# Altium project OSP_DJB_JIG.PrjPcb
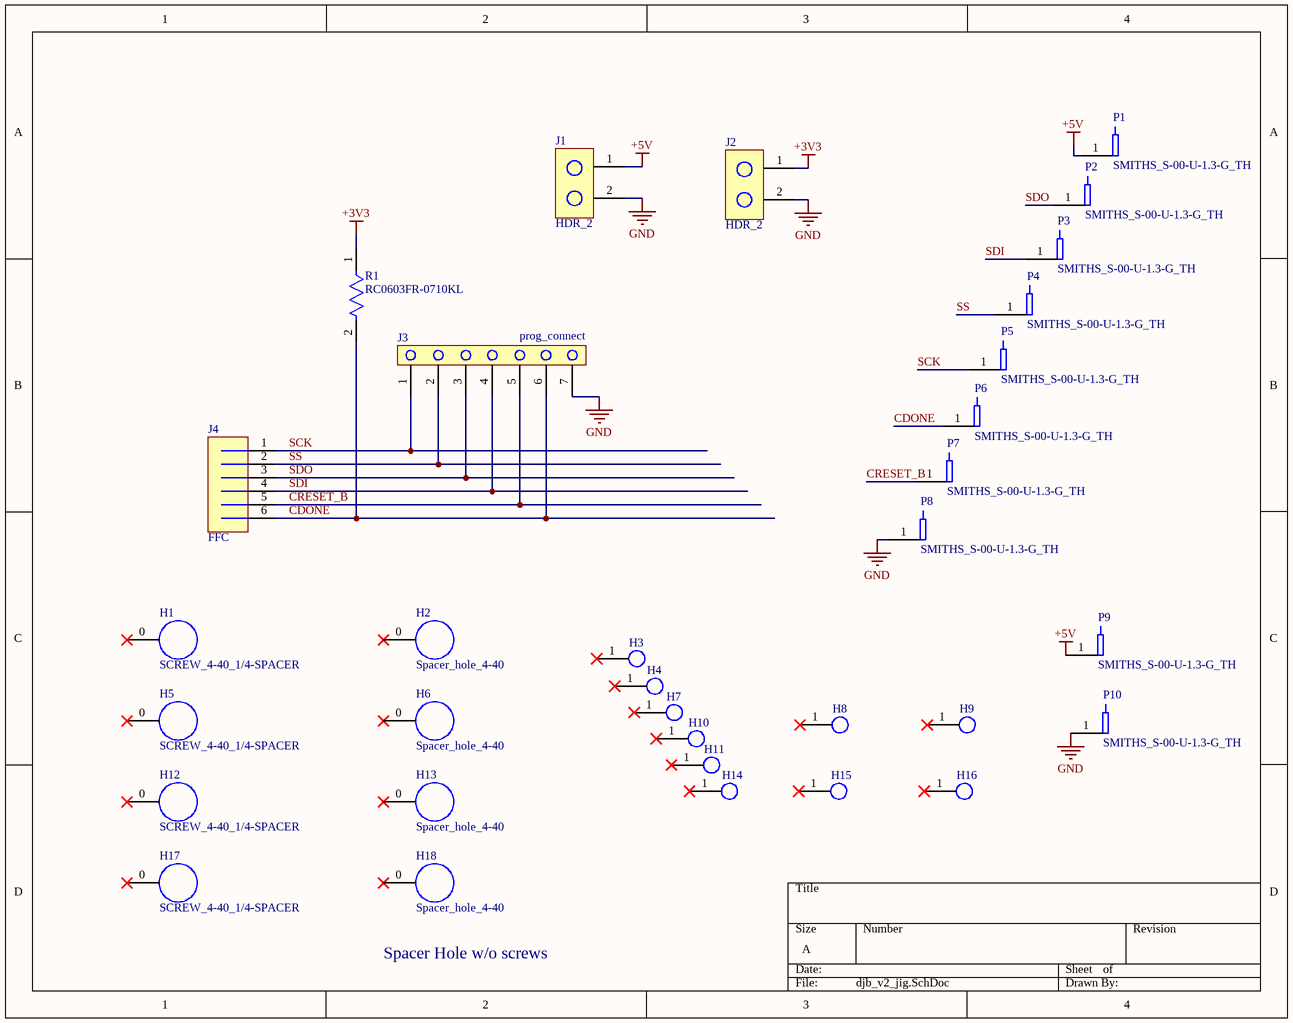
[diagram p0: djb_v2_jig.SchDoc]
1 sheet, 33 parts. Net scope: global (net labels, ports and power ports of the same name join across sheets).
Board files: djb_v2_jig_a.PcbDoc, djb_v2_jig_b.PcbDoc

## Sheet djb_v2_jig.SchDoc
size A; SheetNumber: 1; SheetTotal: 1

### Parts
H1  SCREW_4-40_1/4-SPACER  [SCREW_4-40_1/4-SPACER]
H2  Spacer_hole_4-40  [SPACER_HOLE_4-40]
H3  SMITHS_S-00-U-1.3_hole  [SMITHS_S-00-U-1.3_hole]  (value not drawn)
H4  SMITHS_S-00-U-1.3_hole  [SMITHS_S-00-U-1.3_hole]  (value not drawn)
H5  SCREW_4-40_1/4-SPACER  [SCREW_4-40_1/4-SPACER]
H6  Spacer_hole_4-40  [SPACER_HOLE_4-40]
H7  SMITHS_S-00-U-1.3_hole  [SMITHS_S-00-U-1.3_hole]  (value not drawn)
H8  SMITHS_S-00-U-1.3_hole  [SMITHS_S-00-U-1.3_hole]  (value not drawn)
H9  SMITHS_S-00-U-1.3_hole  [SMITHS_S-00-U-1.3_hole]  (value not drawn)
H10  SMITHS_S-00-U-1.3_hole  [SMITHS_S-00-U-1.3_hole]  (value not drawn)
H11  SMITHS_S-00-U-1.3_hole  [SMITHS_S-00-U-1.3_hole]  (value not drawn)
H12  SCREW_4-40_1/4-SPACER  [SCREW_4-40_1/4-SPACER]
H13  Spacer_hole_4-40  [SPACER_HOLE_4-40]
H14  SMITHS_S-00-U-1.3_hole  [SMITHS_S-00-U-1.3_hole]  (value not drawn)
H15  SMITHS_S-00-U-1.3_hole  [SMITHS_S-00-U-1.3_hole]  (value not drawn)
H16  SMITHS_S-00-U-1.3_hole  [SMITHS_S-00-U-1.3_hole]  (value not drawn)
H17  SCREW_4-40_1/4-SPACER  [SCREW_4-40_1/4-SPACER]
H18  Spacer_hole_4-40  [SPACER_HOLE_4-40]
J1  HDR_2  [2-POS_HEADER]
J2  HDR_2  [2-POS_HEADER]
J3  prog_connect  [7-pos_header]
J4  FFC  [AMPHENOL_HFW6R-1STE1LF]
P1  SMITHS_S-00-U-1.3-G_TH  [SMITHS_S-00-U-1.3-G_TH]
P2  SMITHS_S-00-U-1.3-G_TH  [SMITHS_S-00-U-1.3-G_TH]
P3  SMITHS_S-00-U-1.3-G_TH  [SMITHS_S-00-U-1.3-G_TH]
P4  SMITHS_S-00-U-1.3-G_TH  [SMITHS_S-00-U-1.3-G_TH]
P5  SMITHS_S-00-U-1.3-G_TH  [SMITHS_S-00-U-1.3-G_TH]
P6  SMITHS_S-00-U-1.3-G_TH  [SMITHS_S-00-U-1.3-G_TH]
P7  SMITHS_S-00-U-1.3-G_TH  [SMITHS_S-00-U-1.3-G_TH]
P8  SMITHS_S-00-U-1.3-G_TH  [SMITHS_S-00-U-1.3-G_TH]
P9  SMITHS_S-00-U-1.3-G_TH  [SMITHS_S-00-U-1.3-G_TH]
P10  SMITHS_S-00-U-1.3-G_TH  [SMITHS_S-00-U-1.3-G_TH]
R1  RC0603FR-0710KL  [FP-RC0603-0_55-IPC_C]

### Nets
+3V3: J2.1 R1.1
+5V: J1.1 P1.1 P9.1
GND: J1.2 J2.2 J3.7 P8.1 P10.1
CDONE: J3.6 J4.6 P6.1 R1.2
CRESET_B: J3.5 J4.5 P7.1
SCK: J3.1 J4.1 P5.1
SDI: J3.4 J4.4 P3.1
SDO: J3.3 J4.3 P2.1
SS: J3.2 J4.2 P4.1

Not connected (* = marked no-connect by the designer): H1 0*; H2 0*; H3 1*; H4 1*; H5 0*; H6 0*; H7 1*; H8 1*; H9 1*; H10 1*; H11 1*; H12 0*; H13 0*; H14 1*; H15 1*; H16 1*; H17 0*; H18 0*

### Notes on the sheet
- Spacer Hole w/o screws

### Library data of the parts
H1 H5 H12 H17 = SCREW_4-40_1/4-SPACER: Hole for 4-40 screw with 1/4" spacer
H2 H6 H13 H18 = Spacer_hole_4-40: Spacer hole w/o screw
H3 H4 H7-H11 H14-H16 = SMITHS_S-00-U-1.3_hole: Smiths Interconnect / IDI S-00-U-1.3-G Pogo Pin 0.99mm Centers 16.7mm Long 2.8mm Travel, Mid Mount
J1 J2 = HDR_2: 2-pin 0.1" header
J3 = prog_connect: 7-pos male pin header, 2.54mm pitch
J4 = AMPHENOL_HFW6R-1STE1LF: Amphenol HFW6R-1STE1LF 6-pin flat flexible cable connector
P1-P10 = SMITHS_S-00-U-1.3-G_TH: Smiths Interconnect / IDI S-00-U-1.3-G Pogo Pin 0.99mm Centers 16.7mm Long 2.8mm Travel, Through Hole Mount
R1 = CMP-2100-03664-2: RES 10K OHM 1% 1/10W 0603; Voltage Rating: 75V; Voltage Rating (DC): 50V; Resistance: 10kR; Power Rating: 100mW; Temperature Coefficient: 100ppm/°C; Depth: 0.8mm; Termination: SMD/SMT; Resistor Type: Thick Film; Series: RC; Construction: Rectangular; Features: Moisture Resistant; Packaging: Tape and Reel; Min Operating Temperature: -55°C; Number of Terminations: 2; Lead Pitch: 0.3mm; RoHS Compliant: Yes; Case/Package: 0603; Resistance Tolerance: 1%; Military Standard: Not; Weight: 7.1E-05oz; Number of Pins: 2; Tolerance: 1%; Length: 1.6mm; Case Code (Imperial): 0603; Lead Free: Lead Free; Width: 0.8mm; Max Power Dissipation: 100mW; Height: 0.45mm; Max Operating Temperature: 155°C; Case Code (Metric): 1608; Size Code: 0603